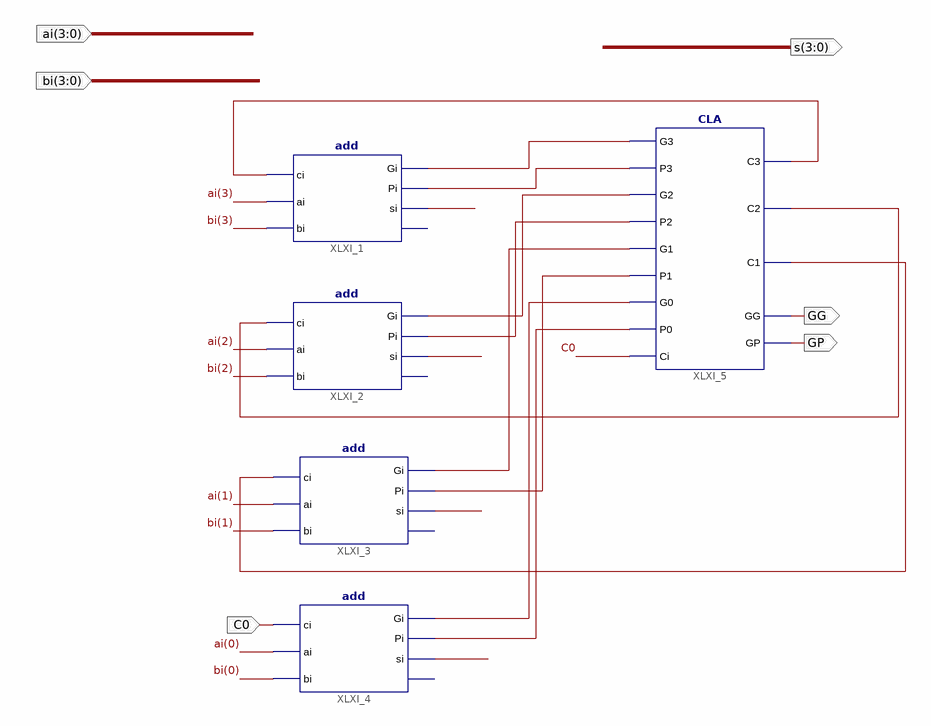
[diagram p0: schematic sheet 1]
// Xilinx ISE schematic add4b.sch (kintex7) as structural Verilog: 5 symbols, 6 ports
module add4b (
  input  [3:0] ai,
  input  [3:0] bi,
  input  C0,
  output [3:0] s,
  output GG,
  output GP
);

  wire XLXN_13, XLXN_14, XLXN_22, XLXN_23, XLXN_24, XLXN_25, XLXN_26, XLXN_27, XLXN_28, XLXN_29, XLXN_30;

  add XLXI_1 (.ci(XLXN_30), .ai(ai[3]), .bi(bi[3]), .si(s[3]), .Gi(XLXN_22), .Pi(XLXN_23));  // open: co
  add XLXI_2 (.ci(XLXN_29), .ai(ai[2]), .bi(bi[2]), .si(s[2]), .Gi(XLXN_24), .Pi(XLXN_25));  // open: co
  add XLXI_3 (.ci(XLXN_28), .ai(ai[1]), .bi(bi[1]), .si(s[1]), .Gi(XLXN_26), .Pi(XLXN_27));  // open: co
  add XLXI_4 (.ci(C0), .ai(ai[0]), .bi(bi[0]), .si(s[0]), .Gi(XLXN_13), .Pi(XLXN_14));  // open: co
  CLA XLXI_5 (
    .G3(XLXN_22), .P3(XLXN_23), .G2(XLXN_24), .P0(XLXN_14), .Ci(C0), .G0(XLXN_13), .P2(XLXN_25),
    .G1(XLXN_26), .P1(XLXN_27), .C3(XLXN_30), .C2(XLXN_29), .C1(XLXN_28), .GP(GP), .GG(GG));
endmodule
